# Altium schematic sheet Sheet2_Fontes_Chaveadas_Controle.SchDoc: Buck 24V 100W - Controle
size A4; ApprovedBy: Prof. Me. Halisson Alves de Oliveira; CheckedBy: Manuel Batista Neto; Author: Artur Alves Torres de Araujo; DrawnBy: Artur Alves Torres de Araujo; Engineer: Artur Alves Torres de Araujo; Organization: UNIFOR - Universidade de Fortaleza; Address1: Av. Washington Soares, 1321; Address2: Edson Queiroz; Address3: CEP: 60811-905; Address4: Fortaleza - CE; DocumentNumber: 3; Revision: v1.0; SheetNumber: 3; SheetTotal: 4; Graduando: Artur Alves Torres de Araujo; matAutor: 1610674; matRevisor: 1710872; Time: 09:24:50; DocumentName: Sheet2_Fontes_Chaveadas_Controle.SchDoc
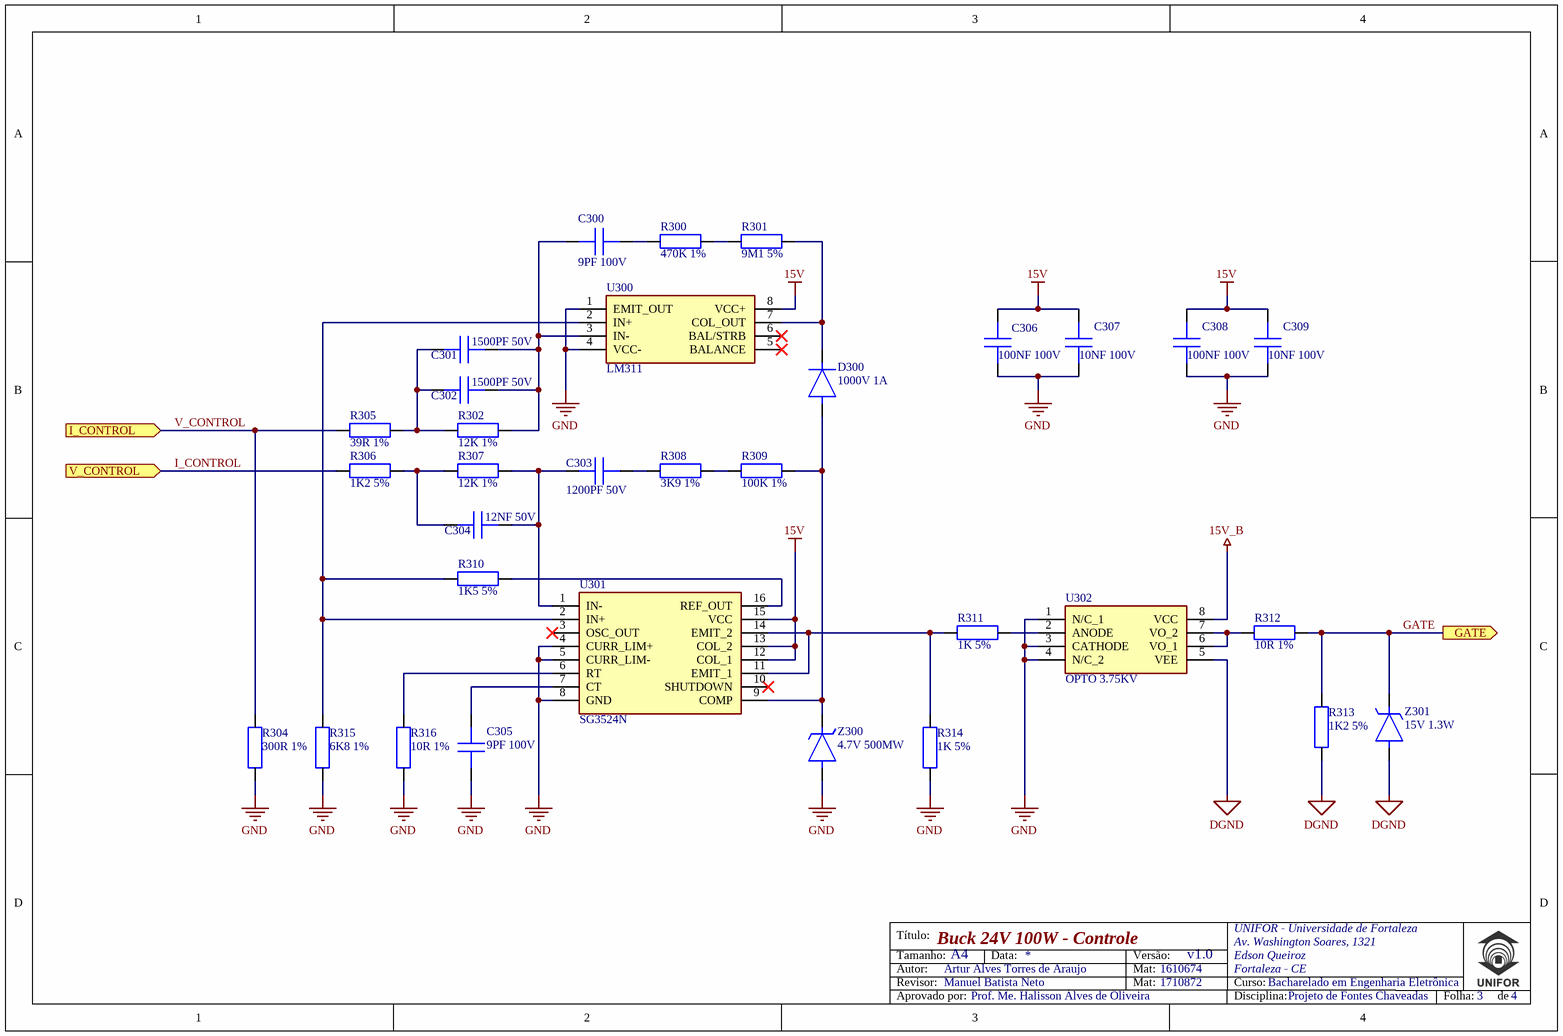
[diagram p0: Sheet2_Fontes_Chaveadas_Controle.SchDoc]

## Parts
C300  9PF 100V  [CAP_RAD_4X2MM5]
C301  1500PF 50V  [CAP_RAD_4X2MM5]
C302  1500PF 50V  [CAP_RAD_4X2MM5]
C303  1200PF 50V  [CAP_RAD_4X2MM5]
C304  12NF 50V  [CAP_RAD_4X2MM5]
C305  9PF 100V  [CAP_RAD_4X2MM5]
C306  100NF 100V  [CAP_RAD_4X2MM5]
C307  10NF 100V  [CAP_RAD_4X2MM5]
C308  100NF 100V  [CAP_RAD_4X2MM5]
C309  10NF 100V  [CAP_RAD_4X2MM5]
D300  1000V 1A  [DIO_PTH_DO41_1N4007]
R300  470K 1%  [RES_PTH_AXIAL_250MW]
R301  9M1 5%  [RES_PTH_AXIAL_250MW]
R302  12K 1%  [RES_PTH_AXIAL_250MW]
R304  300R 1%  [RES_PTH_AXIAL_250MW]
R305  39R 1%  [RES_PTH_AXIAL_250MW]
R306  1K2 5%  [RES_PTH_AXIAL_250MW]
R307  12K 1%  [RES_PTH_AXIAL_250MW]
R308  3K9 1%  [RES_PTH_AXIAL_250MW]
R309  100K 1%  [RES_PTH_AXIAL_250MW]
R310  1K5 5%  [RES_PTH_AXIAL_250MW]
R311  1K 5%  [RES_PTH_AXIAL_250MW]
R312  10R 1%  [RES_PTH_AXIAL_250MW]
R313  1K2 5%  [RES_PTH_AXIAL_250MW]
R314  1K 5%  [RES_PTH_AXIAL_250MW]
R315  6K8 1%  [RES_PTH_AXIAL_250MW]
R316  10R 1%  [RES_PTH_AXIAL_250MW]
U300  LM311  [PTH_8DIP]
U301  SG3524N  [IC_16DIP]
U302  OPTO 3.75KV  [PTH_8DIP]
Z300  4.7V 500MW  [DIO_DO35]
Z301  15V 1.3W  [DIO_1N4744A_DO204AL]

## Ports
GATE (out), I_CONTROL (in), V_CONTROL (in)

## Nets
15V: C306.1 C307.1 C308.1 C309.1 U300.8(VCC+) U301.12(COL_1) U301.13(COL_2) U301.15(VCC)
15V_B: U302.8(VCC)
DGND: R313.2 U302.5(VEE) Z301.2(A)
GND: C305.1 C306.2 C307.2 C308.2 C309.2 R304.1 R314.2 R315.2 R316.1 U300.1(EMIT_OUT) U300.4(VCC-) U301.4(CURR_LIM+) U301.5(CURR_LIM-) U301.8(GND) U302.1(N/C_1) U302.3(CATHODE) U302.4(N/C_2) Z300.2(A)
GATE: R312.2 R313.1 Z301.1(K) ; port GATE
I_CONTROL: R306.1 ; port V_CONTROL
V_CONTROL: R304.2 R305.1 ; port I_CONTROL
NetC300_1: C300.1 R300.2
NetC300_2: C300.2 C301.1 C302.1 R302.1 U300.3(IN-)
NetC301_2: C301.2 C302.2 R302.2 R305.2
NetC303_1: C303.1 C304.1 R307.2 U301.1(IN-)
NetC303_2: C303.2 R308.1
NetC304_2: C304.2 R306.2 R307.1
NetC305_2: C305.2 U301.7(CT)
NetD300_1: D300.1(K) R301.1 U300.7(COL_OUT)
NetD300_2: D300.2(A) R309.2 U301.9(COMP) Z300.1(K)
NetR300_1: R300.1 R301.2
NetR308_2: R308.2 R309.1
NetR310_1: R310.1 R315.1 U300.2(IN+) U301.2(IN+)
NetR310_2: R310.2 U301.16(REF_OUT)
NetR311_1: R311.1 R314.1 U301.11(EMIT_1) U301.14(EMIT_2)
NetR311_2: R311.2 U302.2(ANODE)
NetR312_1: R312.1 U302.6(VO_1) U302.7(VO_2)
NetR316_2: R316.2 U301.6(RT)

Not connected (* = marked no-connect by the designer): U300 5(BALANCE)* 6(BAL/STRB)*; U301 3(OSC_OUT)* 10(SHUTDOWN)*

## Notes on the sheet
- Título:
- Tamanho:
- Revisor:
- Autor:
- A4
- Data:
- Versão:
- Mat:
- Curso:
- Bacharelado em Engenharia Eletrônica
- Aprovado por:
- Disciplina:
- Projeto de Fontes Chaveadas
- Folha:
- de

## Library data of the parts
C300 C305 = CAP_CER_9PF_100V_RAD: CAP CER 9PF 100V C0G RADIAL; PartNumber: FG18C0G2A090DNT06; DkPart: 445-173218-1-ND; Manufacturer: TDK Corporation; DkMOQ: 1; DkPrice: 0,27; BrPrice: 0; Datasheet: https://product.tdk.com/en/system/files?file=dam/doc/product/capacitor/ceramic/lead-mlcc/catalog/leadmlcc_halogenfree_fg_en.pdf
C301 C302 = CAP_CER_1500PF_50V_RAD: CAP CER 1500PF 50V C0G RADIAL; PartNumber: FG18C0G1H152JNT06; DkPart: 445-173177-1-ND; Manufacturer: TDK Corporation; DkMOQ: 1; DkPrice: 0,28; BrPrice: 0; Datasheet: https://product.tdk.com/en/system/files?file=dam/doc/product/capacitor/ceramic/lead-mlcc/catalog/leadmlcc_halogenfree_fg_en.pdf
C303 = CAP_CER_1200PF_50V_RAD: CAP CER 1200PF 50V C0G RADIAL; PartNumber: FA18C0G1H122JNU06; DkPart: 445-180453-1-ND; Manufacturer: TDK Corporation; DkMOQ: 1; DkPrice: 0,3; BrPrice: 0; Datasheet: https://product.tdk.com/en/system/files?file=dam/doc/product/capacitor/ceramic/lead-mlcc/catalog/leadmlcc_halogenfree_fa_en.pdf
C304 = CAP_CER_12NF_50V_RAD: CAP CER 0.012UF 50V C0G/NP0 RAD; PartNumber: RCE5C1H123J1DBH03A; DkPart: 490-7332-1-ND; Manufacturer: Murata Electronics; DkMOQ: 1; DkPrice: 0,73; BrPrice: 0; Datasheet: https://search.murata.co.jp/Ceramy/image/img/A01X/G101/ENG/RCE_C0G_50V-100V_E.pdf
C306 C308 = CAP_CER_100NF_100V_RAD: CAP CER 0.1UF 100V X7S RADIAL; PartNumber: FG18X7S2A104KRT06; DkPart: 445-173281-1-ND; Manufacturer: TDK Corporation; DkMOQ: 1; DkPrice: 0,38; BrPrice: 0; Datasheet: https://product.tdk.com/en/system/files?file=dam/doc/product/capacitor/ceramic/lead-mlcc/catalog/leadmlcc_halogenfree_fg_en.pdf
C307 C309 = CAP_CER_10NF_100V_RAD: CAP CER 10NF 100V C0G/NP0 RADIAL; PartNumber: FA18C0G2A103JRU06; DkPart: 445-175393-1-ND; Manufacturer: TDK Corporation; DkMOQ: 1; DkPrice: 0,44; BrPrice: 0; Datasheet: https://product.tdk.com/en/system/files?file=dam/doc/product/capacitor/ceramic/lead-mlcc/catalog/leadmlcc_halogenfree_fa_en.pdf
D300 = DIO_PTH_STD_1000V_1A_1N4007: DIODE GEN PURP 1KV 1A DO41; PartNumber: 1N4007-TP; DkPart: 1N4007-TPMSCT-ND; Manufacturer: Micro Commercial Co; DkMOQ: 1; DkPrice: 0,22; BrPrice: 0; Datasheet: https://www.mccsemi.com/pdf/Products/1N4001~1N4007(DO-41).pdf
R300 = RES_470K_1%_250MW_AXIAL: RES 470K OHM 1% 1/4W AXIAL; PartNumber: MFR-25FRF52-470K; DkPart: 13-MFR-25FRF52-470KCT-ND; Manufacturer: YAGEO; DkMOQ: 1; DkPrice: 0,1; BrPrice: 0; Datasheet: https://www.yageo.com/upload/media/product/productsearch/datasheet/lr/YAGEO%20MFR_datasheet_2021v1.pdf
R301 = RES_9M1_5%_250MW_AXIAL: RES 9.1M OHM 5% 1/4W AXIAL; PartNumber: CFR-25JB-52-9M1; DkPart: 9.1MQBK-ND; Manufacturer: YAGEO; DkMOQ: 1; DkPrice: 0,1; BrPrice: 0; Datasheet: https://www.yageo.com/upload/media/product/productsearch/datasheet/lr/YAGEO%20CFR_datasheet_2021v0.pdf
R302 R307 = RES_12K_1%_250MW_AXIAL: RES 12K OHM 1% 1/4W AXIAL; PartNumber: MFR-25FTE52-12K; DkPart: 13-MFR-25FTE52-12KCT-ND; Manufacturer: YAGEO; DkMOQ: 1; DkPrice: 0,1; BrPrice: 0; Datasheet: https://www.yageo.com/upload/media/product/productsearch/datasheet/lr/YAGEO%20MFR_datasheet_2021v1.pdf
R304 = RES_300R_1%_250MW_AXIAL: RES 300 OHM 1% 1/4W AXIAL; PartNumber: RNMF14FTC300R; DkPart: S300CACT-ND; Manufacturer: Stackpole Electronics Inc; DkMOQ: 1; DkPrice: 0,1; BrPrice: 0; Datasheet: https://www.seielect.com/catalog/sei-rnf_rnmf.pdf
R305 = RES_39R_1%_250MW_AXIAL: RES 39 OHM 1% 1/4W AXIAL; PartNumber: MFR-25FTE52-39R; DkPart: 13-MFR-25FTE52-39RCT-ND; Manufacturer: YAGEO; DkMOQ: 1; DkPrice: 0,1; BrPrice: 0; Datasheet: https://www.yageo.com/upload/media/product/productsearch/datasheet/lr/YAGEO%20MFR_datasheet_2021v1.pdf
R306 R313 = RES_1K2_5%_250MW_AXIAL: RES 1.2K OHM 5% 1/4W AXIAL; PartNumber: CFR-25JB-52-1K2; DkPart: 1.2KQBK-ND; Manufacturer: YAGEO; DkMOQ: 1; DkPrice: 0,1; BrPrice: 0; Datasheet: https://www.yageo.com/upload/media/product/productsearch/datasheet/lr/YAGEO%20CFR_datasheet_2021v0.pdf
R308 = RES_3K9_1%_600MW_AXIAL: RES 3.9K OHM 1% 0.6W AXIAL; PartNumber: MF0207FTE52-3K9; DkPart: 13-MF0207FTE52-3K9CT-ND; Manufacturer: YAGEO; DkMOQ: 1; DkPrice: 0,12; BrPrice: 0; Datasheet: https://www.yageo.com/upload/media/product/productsearch/datasheet/lr/YAGEO%20MF0_datasheet_2021v1.pdf
R309 = RES_100K_1%_250MW_AXIAL: RES 100K OHM 1% 1/4W AXIAL; PartNumber: FMF-25FTF52-100K; DkPart: 13-FMF-25FTF52-100KCT-ND; Manufacturer: YAGEO; DkMOQ: 1; DkPrice: 0,13; BrPrice: 0; Datasheet: https://www.yageo.com/upload/media/product/productsearch/datasheet/lr/YAGEO%20FMF_datasheet_2021v0.pdf
R310 = RES_1K5_5%_250MW_AXIAL: RES 1.5K OHM 5% 1/4W AXIAL; PartNumber: FMP100JR-52-1K5; DkPart: 1.5KWCT-ND; Manufacturer: YAGEO; DkMOQ: 1; DkPrice: 0,2; BrPrice: 0; Datasheet: https://www.yageo.com/upload/media/product/productsearch/datasheet/lr/YAGEO%20FMP_datasheet_2021v2.pdf
R311 R314 = RES_1K_5%_250MW_AXIAL: RES 1K OHM 5% 1/4W AXIAL; PartNumber: CFR-25JB-52-1K; DkPart: 1.0KQBK-ND; Manufacturer: YAGEO; DkMOQ: 1; DkPrice: 0,1; BrPrice: 0; Datasheet: https://www.yageo.com/upload/media/product/productsearch/datasheet/lr/YAGEO%20CFR_datasheet_2021v0.pdf
R312 R316 = RES_10R_1%_250MW_AXIAL: RES 10 OHM 1% 1/4W AXIAL; PartNumber: MFR-25FTE52-10R; DkPart: 13-MFR-25FTE52-10RCT-ND; Manufacturer: YAGEO; DkMOQ: 1; DkPrice: 0,1; BrPrice: 0; Datasheet: https://www.yageo.com/upload/media/product/productsearch/datasheet/lr/YAGEO%20MFR_datasheet_2021v1.pdf
R315 = RES_6K8_1%_250MW_AXIAL: RES 6.8K OHM 1% 1/4W AXIAL; PartNumber: MFR-25FTE52-6K8; DkPart: 13-MFR-25FTE52-6K8CT-ND; Manufacturer: YAGEO; DkMOQ: 1; DkPrice: 0,1; BrPrice: 0; Datasheet: https://www.yageo.com/upload/media/product/productsearch/datasheet/lr/YAGEO%20MFR_datasheet_2021v1.pdf
U300 = IC_OPAMP_LM311: IC DIFF COMP W/STROBE 8DIP; DkPart: 296-1389-5-ND; Manufacturer: Texas Instruments; PartNumber: LM311P; DkMOQ: 1; DkPrice: 0,57; BrPrice: 0; Datasheet: https://www.ti.com/general/docs/suppproductinfo.tsp?distId=10&gotoUrl=https%3A%2F%2Fwww.ti.com%2Flit%2Fgpn%2Flm211
U301 = IC_SG3524NG4: IC REG CTRLR MULT TOPOLOGY 16DIP; DkPart: 296-9687-5-ND; Manufacturer: Texas Instruments; DkMOQ: 1; DkPrice: 0,75; BrPrice: 0; PartNumber: SG3524N; Datasheet: https://www.ti.com/general/docs/suppproductinfo.tsp?distId=10&gotoUrl=https%3A%2F%2Fwww.ti.com%2Flit%2Fgpn%2Fsg2524
U302 = OPTO_HCPL3120000E: OPTOISO 3.75KV 1CH GATE DVR 8DIP; DkPart: 516-1476-5-ND; Manufacturer: Broadcom Limited; PartNumber: HCPL-3120-000E; DkMOQ: 1; DkPrice: 3,17; BrPrice: 0; Datasheet: https://docs.broadcom.com/doc/AV02-0161EN
Z300 = DIO_PTH_ZENER_4V7_500MW_DO35: DIODE ZENER 4.7V 500MW DO35; PartNumber: 1N5230B; DkPart: 1N5230B-ND; Manufacturer: onsemi; DkMOQ: 1; DkPrice: 0,16; BrPrice: 0; Datasheet: https://www.onsemi.com/pdf/datasheet/1n5221b-d.pdf
Z301 = DIO_PTH_ZENER_15V_1W3_1N4744A: DIODE ZENER 15V 1.3W DO41; DkPart: 1N4744AVSCT-ND; Manufacturer: Vishay General Semiconductor; PartNumber: 1N4744A-TR; DkMOQ: 1; DkPrice: 0,33; BrPrice: 0; Datasheet: https://www.vishay.com/docs/85816/1n4728a.pdf